# EAGLE design MiSTer Vector v1.0 (EAGLE 7.1.0)
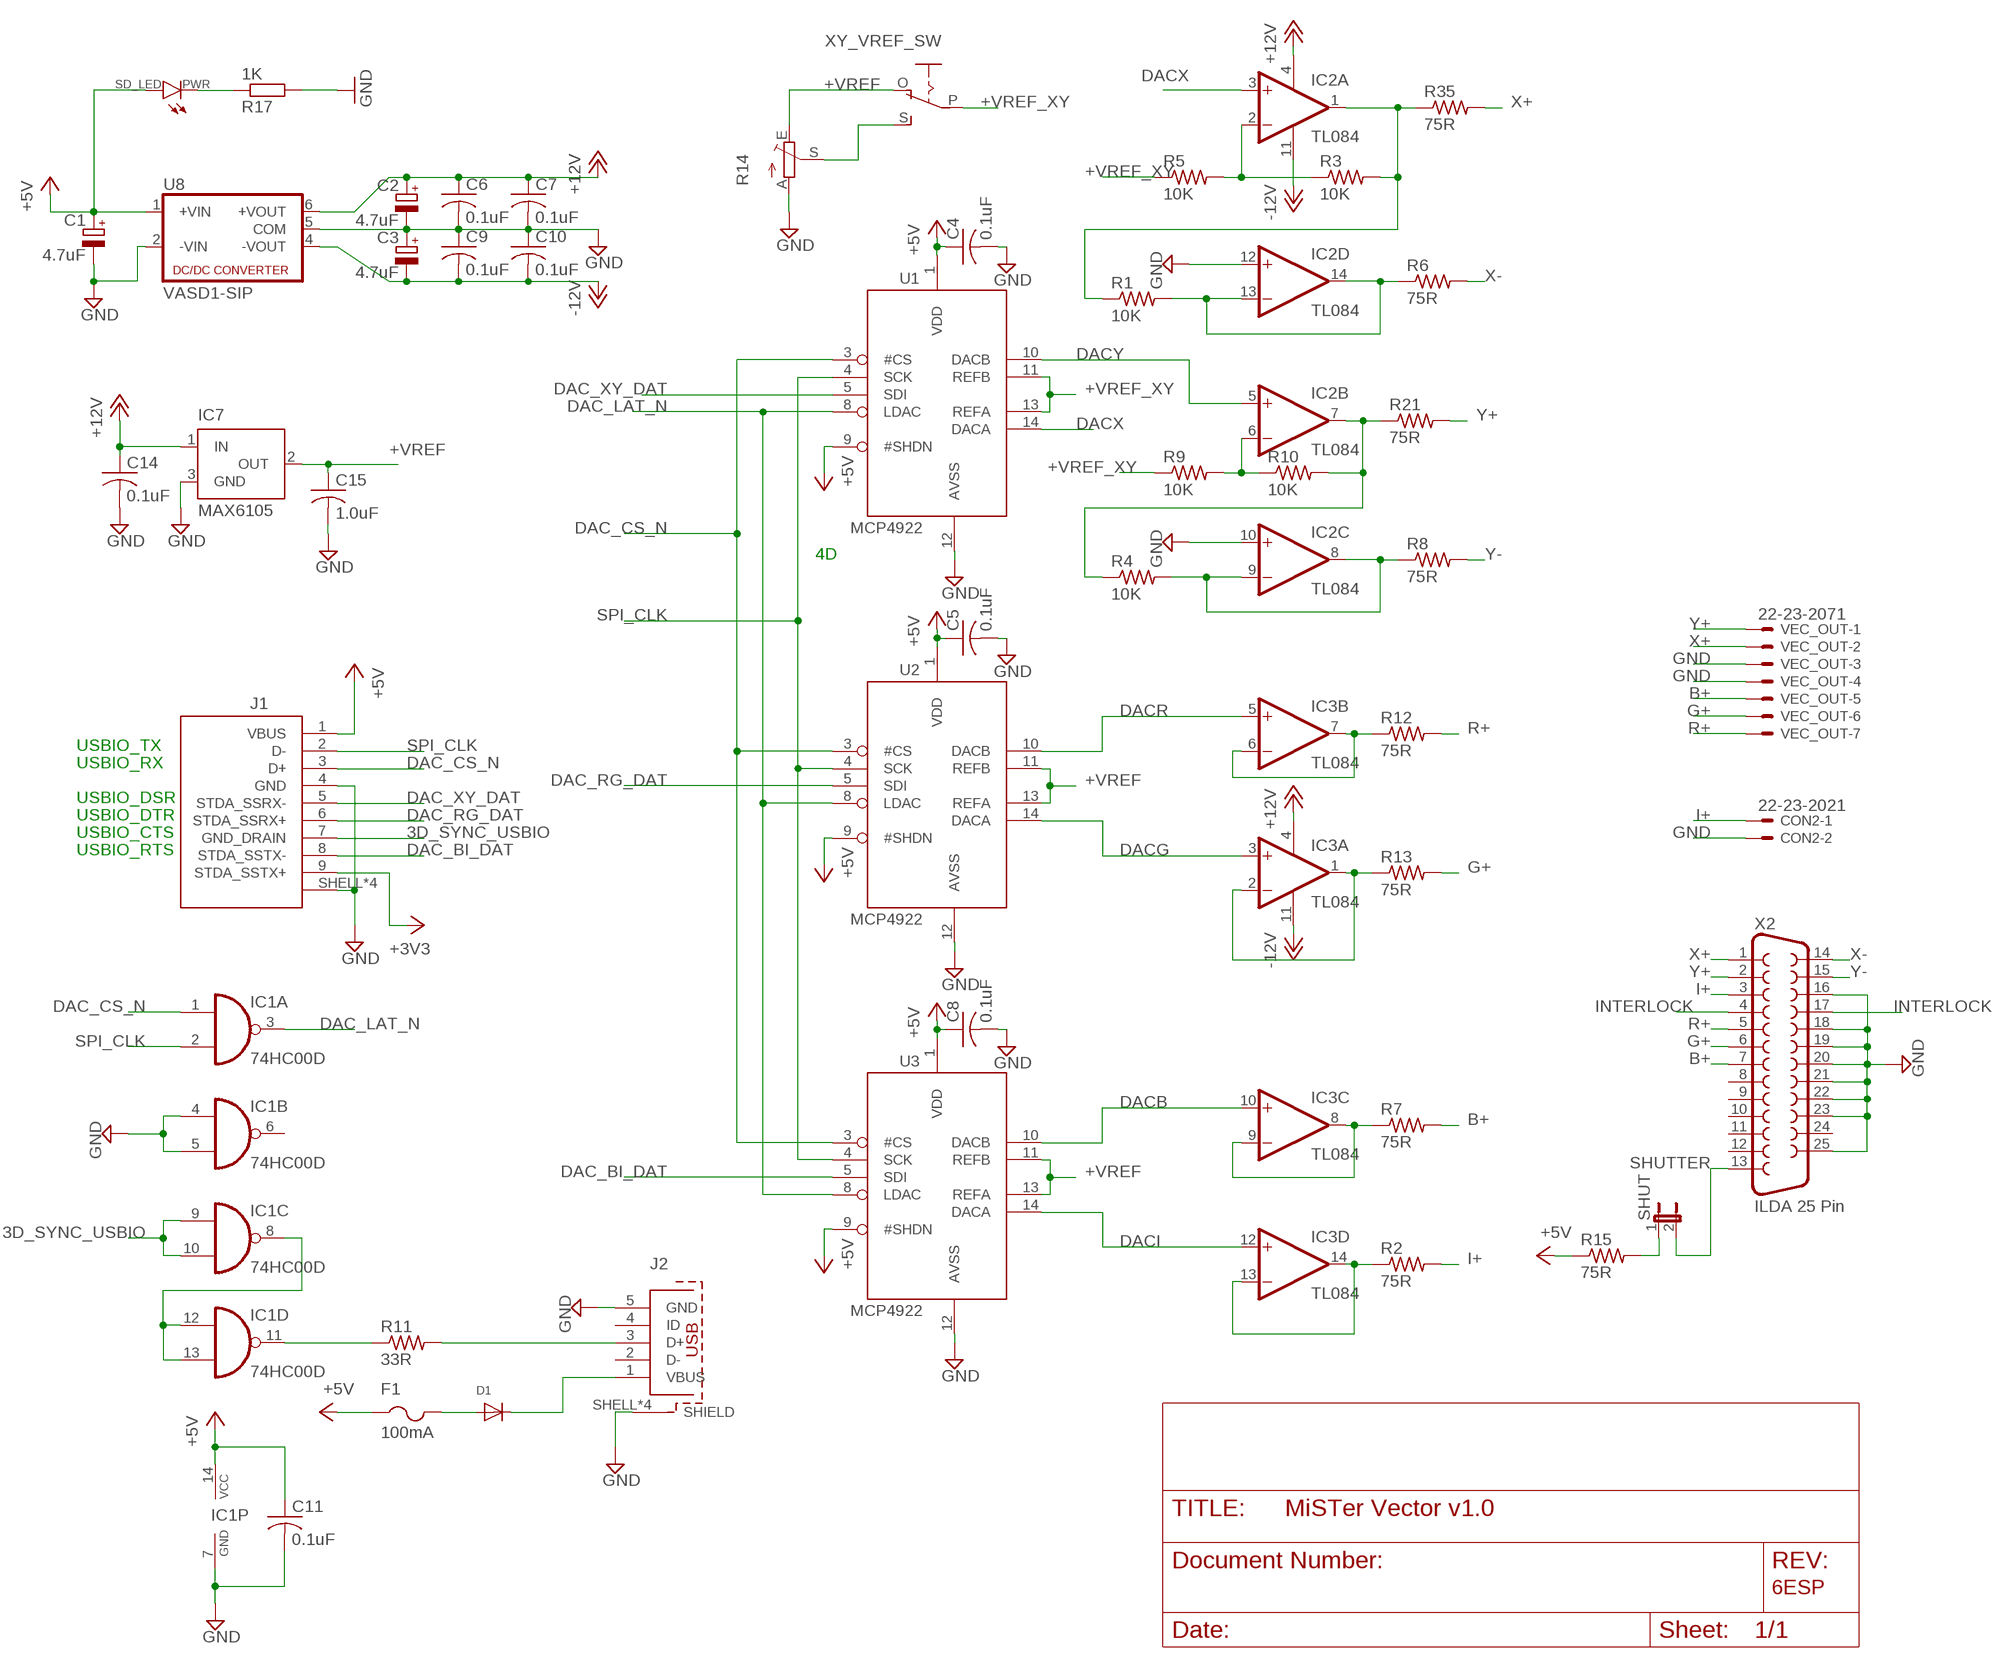
[diagram p0: schematic, sheet 1]

## Parts
C1  4.7uF  CPOL-EUCT6032  [CT6032]
C2  4.7uF  CPOL-EUCT6032  [CT6032]
C3  4.7uF  CPOL-EUCT6032  [CT6032]
C4  0.1uF  C-USC0603  [C0603]
C5  0.1uF  C-USC0603  [C0603]
C6  0.1uF  C-USC0603  [C0603]
C7  0.1uF  C-USC0603  [C0603]
C8  0.1uF  C-USC0603  [C0603]
C9  0.1uF  C-USC0603  [C0603]
C10  0.1uF  C-USC0603  [C0603]
C11  0.1uF  C-USC0603  [C0603]
C14  0.1uF  C-USC0603  [C0603]
C15  1.0uF  C-USC0603  [C0603]
CON2  22-23-2021  [22-23-2021]
D1  DIODESOD-323F  [SOD-323F]
F1  100mA  PTCFUSE-1206  [R1206]
IC1  74HC00D  [SO14]
IC2  TL084  [SOIC-14]
IC3  TL084  [SOIC-14]
IC7  MAX6105  MAX6520  [SOT23]
J1  692121230100  [692121230100]
J2  65100516121  [65100516121]
PWR  SD_LED  LED0805  [0805_POL]
R1  10K  R-US_R0603  [R0603]
R2  75R  R-US_R0603  [R0603]
R3  10K  R-US_R0603  [R0603]
R4  10K  R-US_R0603  [R0603]
R5  10K  R-US_R0603  [R0603]
R6  75R  R-US_R0603  [R0603]
R7  75R  R-US_R0603  [R0603]
R8  75R  R-US_R0603  [R0603]
R9  10K  R-US_R0603  [R0603]
R10  10K  R-US_R0603  [R0603]
R11  33R  R-US_R0603  [R0603]
R12  75R  R-US_R0603  [R0603]
R13  75R  R-US_R0603  [R0603]
R14  TRIM_EU-B25P  [B25P]
R15  75R  R-US_R0603  [R0603]
R17  1K  R-EU_R0603  [R0603]
R21  75R  R-US_R0603  [R0603]
R35  75R  R-US_R0603  [R0603]
SHUT  JP1E  [JP1]
U1  MCP4922  [SOIC-14]
U2  MCP4922  [SOIC-14]
U3  MCP4922  [SOIC-14]
U8  VASD1-SIP  NMA  [NMA]
VEC_OUT  22-23-2071  [22-23-2071]
X2  ILDA 25 Pin  F25D  [F25D]
XY_VREF_SW  EG1218S  [EG1218]

## Nets
3D_SYNC_USBIO: IC1.9(C:I0) IC1.10(C:I1) J1.7(GND_DRAIN)
+3V3: J1.9(STDA_SSTX+)
+5V: C1.+ C4.1 C5.1 C8.1 C11.1 F1.1 IC1.14(P:VCC) J1.1(VBUS) PWR.+(A) R15.1 U1.1(VDD) U1.9(#SHDN) U2.1(VDD) U2.9(#SHDN) U3.1(VDD) U3.9(#SHDN) U8.1(+VIN)
+12V: C2.+ C6.1 C7.1 C14.1 IC2.4(A:V+) IC3.4(A:V+) IC7.1(IN) U8.6(+VOUT)
+VREF: C15.1 IC7.2(OUT) R14.E U2.11(REFB) U2.13(REFA) U3.11(REFB) U3.13(REFA) XY_VREF_SW.O
+VREF_XY: R5.1 R9.1 U1.11(REFB) U1.13(REFA) XY_VREF_SW.P
-12V: C3.- C9.2 C10.2 IC2.11(A:V-) IC3.11(A:V-) U8.4(-VOUT)
B1+: IC3.8(C:OUT) IC3.9(C:-IN) R7.1
B+: R7.2 VEC_OUT.5 X2.7
DAC_BI_DAT: J1.8(STDA_SSTX-) U3.5(SDI)
DAC_CS_N: IC1.1(A:I0) J1.3(D+) U1.3(#CS) U2.3(#CS) U3.3(#CS)
DAC_LAT_N: IC1.3(A:O) U1.8(LDAC) U2.8(LDAC) U3.8(LDAC)
DAC_RG_DAT: J1.6(STDA_SSRX+) U2.5(SDI)
DAC_XY_DAT: J1.5(STDA_SSRX-) U1.5(SDI)
DACB: IC3.10(C:+IN) U3.10(DACB)
DACG: IC3.3(A:+IN) U2.14(DACA)
DACI: IC3.12(D:+IN) U3.14(DACA)
DACR: IC3.5(B:+IN) U2.10(DACB)
DACX: IC2.3(A:+IN) U1.14(DACA)
DACY: IC2.5(B:+IN) U1.10(DACB)
G1+: IC3.1(A:OUT) IC3.2(A:-IN) R13.1
G+: R13.2 VEC_OUT.6 X2.6
GND: C1.- C2.- C3.+ C4.2 C5.2 C6.2 C7.2 C8.2 C9.1 C10.1 C11.2 C14.2 C15.2 CON2.2 IC1.4(B:I0) IC1.5(B:I1) IC1.7(P:GND) IC2.10(C:+IN) IC2.12(D:+IN) IC7.3(GND) J1.4(GND) J1.SHELL1(SHIELD) J1.SHELL2(SHIELD) J1.SHELL3(SHIELD) J1.SHELL(SHIELD) J2.5(GND) J2.SHELL1(SHIELD) J2.SHELL2(SHIELD) J2.SHELL3(SHIELD) J2.SHELL(SHIELD) R14.A R17.2 U1.12(AVSS) U2.12(AVSS) U3.12(AVSS) U8.2(-VIN) U8.5(COM) VEC_OUT.3 VEC_OUT.4 X2.16 X2.18 X2.19 X2.20 X2.21 X2.22 X2.23 X2.25
I1+: IC3.13(D:-IN) IC3.14(D:OUT) R2.1
I+: CON2.1 R2.2 X2.3
INTERLOCK: X2.4 X2.17
N$1: IC2.1(A:OUT) R1.1 R3.2 R35.1
N$2: IC2.7(B:OUT) R4.1 R10.2 R21.1
N$3: IC2.6(B:-IN) R9.2 R10.1
N$4: IC2.8(C:OUT) IC2.9(C:-IN) R4.2 R8.1
N$5: IC2.13(D:-IN) IC2.14(D:OUT) R1.2 R6.1
N$6: D1.C J2.1(VBUS)
N$7: IC1.11(D:O) R11.1
N$8: IC1.8(C:O) IC1.12(D:I0) IC1.13(D:I1)
N$9: J2.3(D+) R11.2
N$10: PWR.-(C) R17.1
N$11: D1.A F1.2
N$12: R15.2 SHUT.1
N$13: R14.S XY_VREF_SW.S
N$30: IC2.2(A:-IN) R3.1 R5.2
R1+: IC3.6(B:-IN) IC3.7(B:OUT) R12.1
R+: R12.2 VEC_OUT.7 X2.5
SHUTTER: SHUT.2 X2.13
SPI_CLK: IC1.2(A:I1) J1.2(D-) U1.4(SCK) U2.4(SCK) U3.4(SCK)
X+: R35.2 VEC_OUT.2 X2.1
X-: R6.2 X2.14
Y+: R21.2 VEC_OUT.1 X2.2
Y-: R8.2 X2.15
Unconnected: IC1.6(B:O) J2.2(D-) J2.4(ID) X2.8 X2.9 X2.10 X2.11 X2.12 X2.24

## Notes on the sheet
- 4D
- USBIO_TX
- USBIO_RX
- USBIO_DSR
- USBIO_DTR
- USBIO_CTS
- USBIO_RTS
- 6ESP

## Library data of the parts
C1-C3 = rcl:CPOL-EU: POLARIZED CAPACITOR, European symbol
C4-C11 C14 C15 = adafruit:C-US: CAPACITOR, American symbol
CON2 = con-molex:22-23-2021: .100" (2.54mm) Center Header - 2 Pin; MF: MOLEX; MPN: 22-23-2021; OC_FARNELL: 1462926; OC_NEWARK: 25C3832
D1 = adafruit:DIODE: Diode SMADIODE - SMA Surface Mount Package 20V 1A Schottky Diode Digikey: 641-1014-6-ND DO-1N4148 - Through Hole Small Current Diode SOD-123 20V 1 A (.5mV Vf) Schottky Diode - Digikey: MBRX120TPMSCT-ND SOD-323 10V 570mA (.38mV Vf, 3ns) Schottky Diode - Digikey: ZLLS410CT-ND SOD-523 30V 30mA Schottky Diode (RB751S-40TE61) - Digikey: RB751S-40TE61CT-ND SOT23-R/W - SOT23 Package (R = Solder Paste/Reflow Ovens, W = Hand-Soldering) BAT54Film 40V 300mA - Digikey: 497-7162-1-ND
F1 = adafruit:PTCFUSE: PTC fuses, resettable thermistors
IC1 = 74xx-eu:74*00: Quad 2-input NAND gate
IC2 IC3 = favreau:TL084: Texas Instruments TL084 JFET General Purpose Op-Amp
IC7 = maxim:MAX6520: 1.2V Voltage Reference 50ppm/°C, SOT23, 3-Terminal Source: Data sheet <http://datasheets.maxim-ic.com/en/ds/MAX6520.pdf>; MF: MAXIM; MPN: MAX6520EUR-T; OC_FARNELL: unknown; OC_NEWARK: 02J4586
J1 = 632723100011_Eagle_WR-USB_rev19b:692121230100: WR-COM - USB 3.0 HORIZONTAL TYPE A WITH OFFSET 1.04 MM Characteristics MATERIAL PROPERTIES INSULATOR: Color Blue Insulator Material LCP Contact Material Phosphor Bronze Contact Plating Mat Tin over Nickel Contact Type Stamped Cover Material Brass Cover PlatingMat Tin KIND PROPERTIES Quality Class50 000 Mating cycles GENERAL INFORMATION Operating Temperature -20 °C up to +60 °C Insulator Flammability Rating UL94-V0 ELECTRICAL PROPERTIES Rated Current 0.25 A Working Voltage 30 V (AC) Withstanding Voltage 100 V (AC) Contact Resistance 50 mΩ Insulation Resistance 100 MΩ PACKAGING PROPERTIES Packaging Tape and Reel <http://katalog.we-online.de/media/images/v2/Family_WR-COM_692121230100.jpg> Details see: http://katalog.we-online.de/en/em/COM_3_0_TYPE_A_HORIZONTAL_W_OFFSET_1_04MM 2016 (C) Wurth Elektronik
J2 = 632723100011_Eagle_WR-USB_rev19b:65100516121: WR-COM SMT Horizontal 5 Contacts Mini USB Typ B=>Code : Con_I-O_COM_MiniUSB_65100516121 <http://katalog.we-online.de/media/images/eican/Con_I-O_COM_MiniUSB_65100516121_pf2.jpg> Details see: http://katalog.we-online.de/en/em/COM_SMT_MINI_TYPE_B_HORIZONTAL/65100516121 Created 2014-07-09, Karrer Zheng 2014 (C) Würth Elektronik
PWR = dan-led:LED: LED
R1-R13 R15 R21 R35 = resistor:R-US_: RESISTOR, American symbol
R14 = pot:TRIM_EU-: POTENTIOMETER
R17 = rcl:R-EU_: RESISTOR, European symbol
SHUT = jumper:JP1E: JUMPER
U1-U3 = favreau:MCP4922
U8 = dc-dc-converter:NMA: DC-DC CONVERTER; MF: C & D TECHNOLOGIES, INC; MPN: NMA0515SC; OC_FARNELL: 1021434; OC_NEWARK: 61K3064
VEC_OUT = con-molex:22-23-2071: .100" (2.54mm) Center Header - 7 Pin; MF: MOLEX; MPN: 22-23-2071; OC_FARNELL: 1654534; OC_NEWARK: 56H0445
X2 = SparkFun:F25: D-SUB 25 25 Pin male connector. PCB edge mount for regular PCB thicknesses. This connector will connect directly to the back of a PC parallel port or through a normal DB25 extension cable (M/F). SKU: PRT-08287
XY_VREF_SW = adafruit:EG1218: SLIDING SWITCH 0.1" spacing through hole, vertical SPDT slide switch http://www.ladyada.net/library/pcb/eaglelibrary.html

## Board
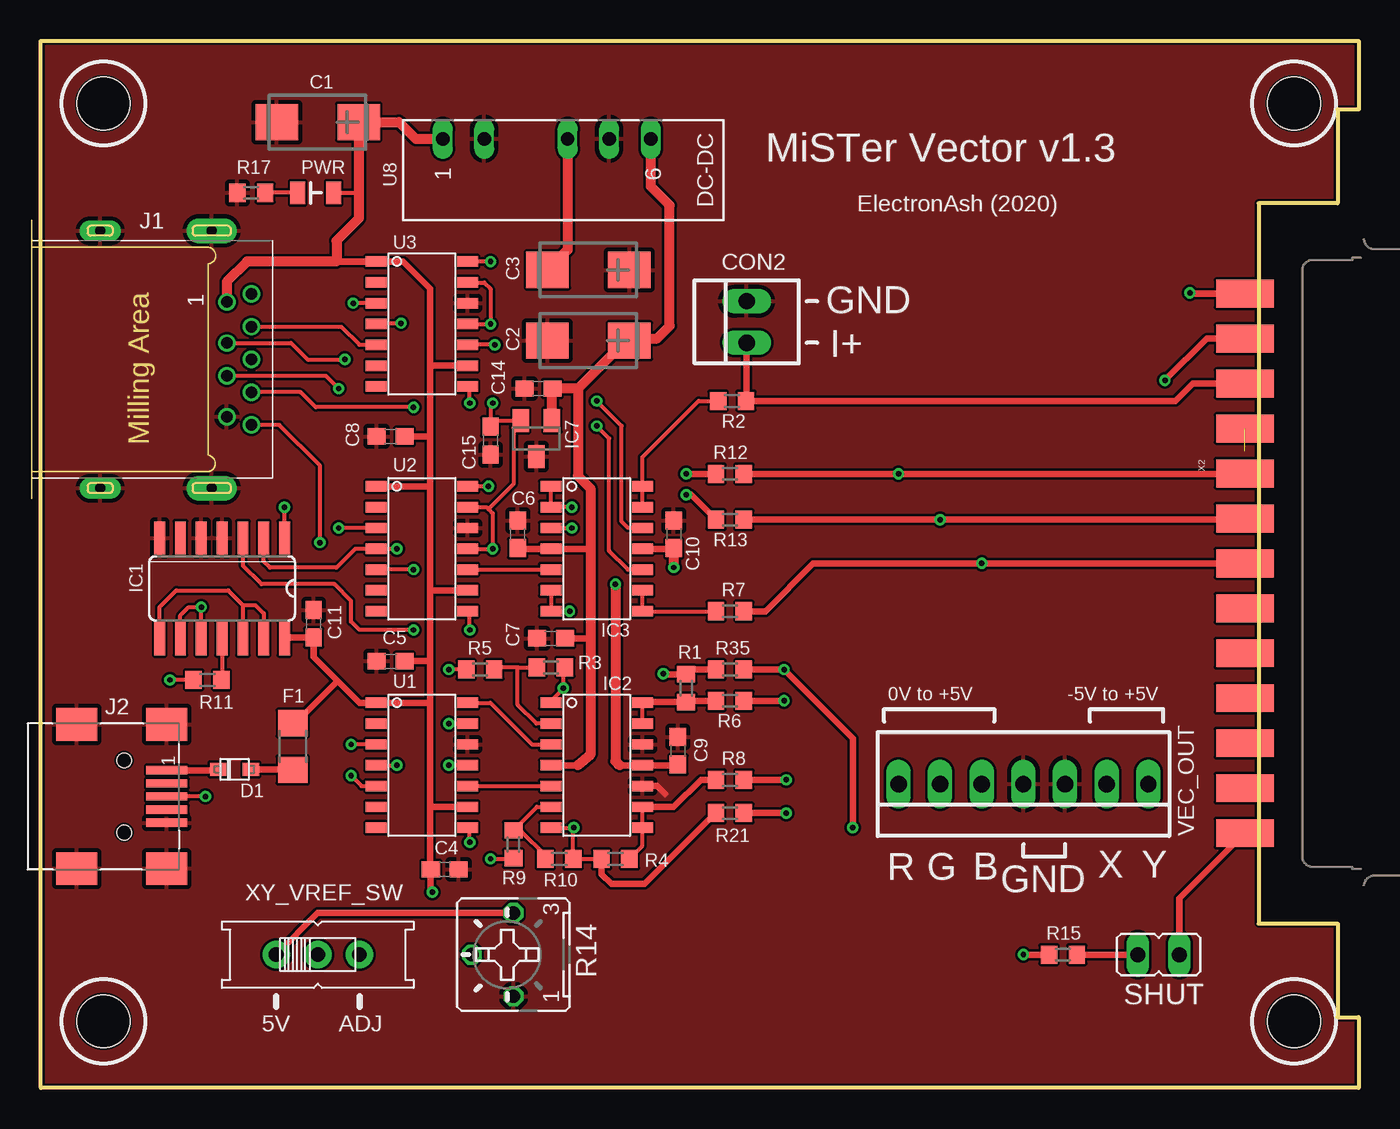
[diagram p1: board, top side]
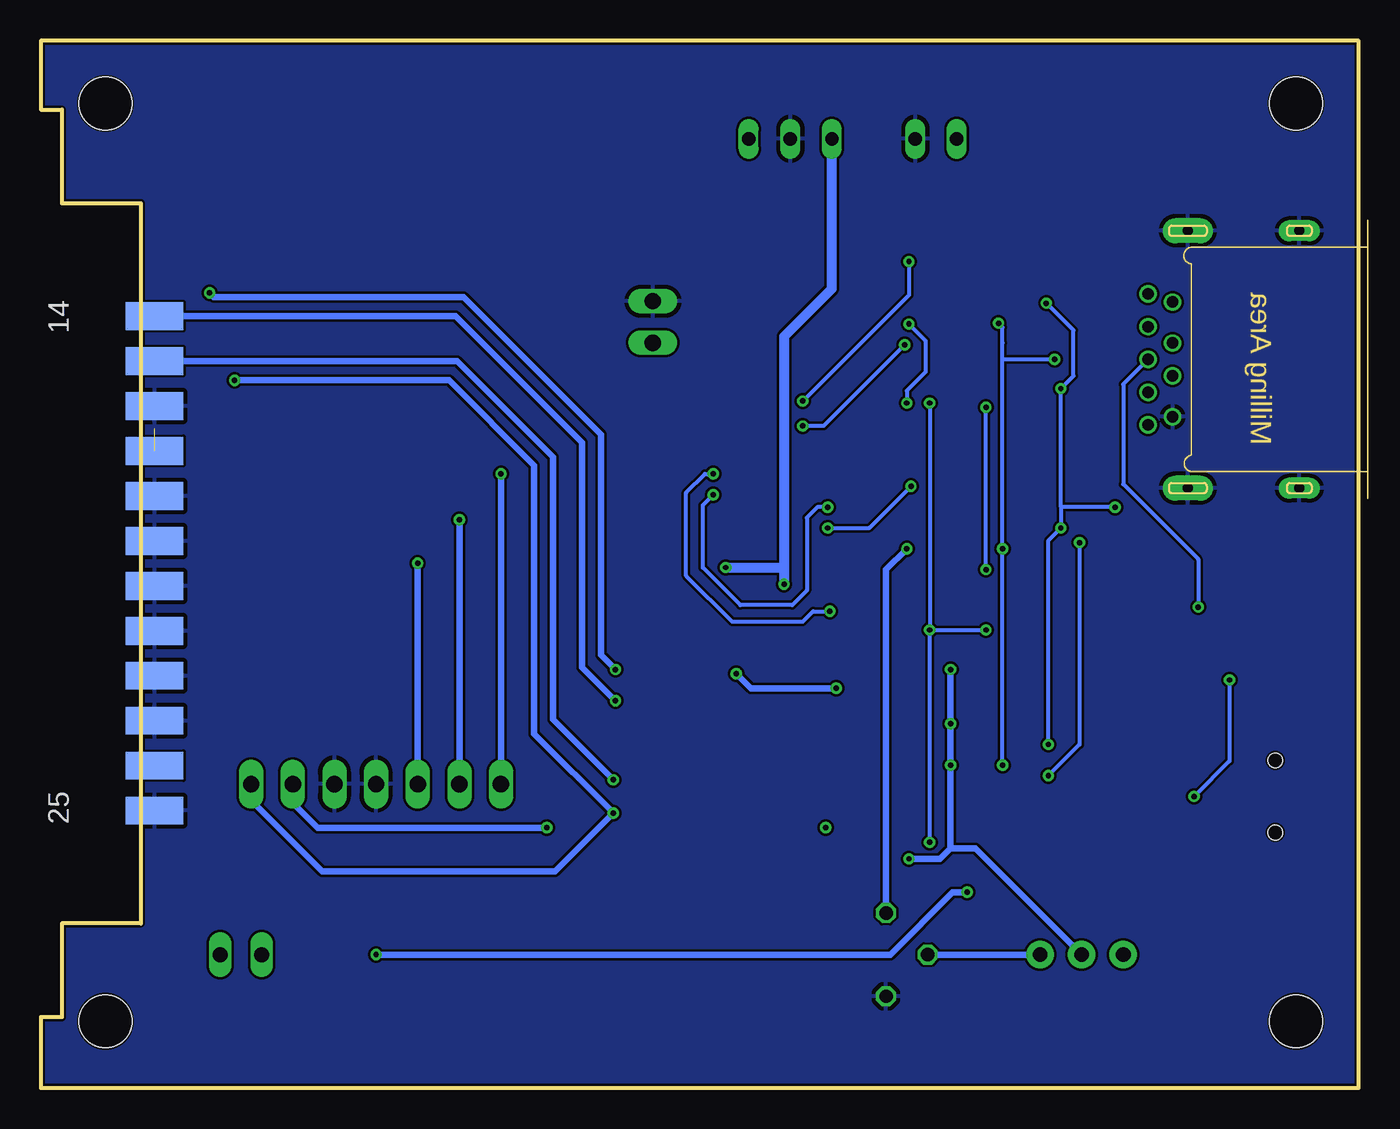
[diagram p2: board, bottom side, seen from below]

Size 80.39 x 63.88 mm. Coordinates in mm from the lower left corner, seen from the top.
Outline: 0,63.88 80.39,63.88 80.39,59.69 79.12,59.69 79.12,53.98 74.3,53.98 74.3,10.03 79.12,10.03 79.12,4.32 80.39,4.32 80.39,0 0,0 0,63.88
Copper layers (1*16): Top 0.0356mm / dielectric 1.5011mm / Bottom 0.0356mm
Design rules "LaenPCBOrder *": minimum track width 6mil, minimum drill 13mil, track to track 6mil, track to pad 6mil, pad to pad 6mil, via to via 6mil, smd to smd 6mil, copper to edge 5mil, drill to drill 6mil, minimum pad ring 7mil, minimum via ring 7mil, stop-mask expansion 4mil, vias tented up to drill 0mil, thermal gap 10mil
Holes 3.2 mm at 3.81,4.06 3.81,60.07 76.45,4.06 76.45,60.07

### Footprints (pad centres in the part's own frame; a part is rotated, then mirrored left to right if it is on the bottom)
CT6032 = smd 2.6 x 2.2: + -2.5,0; - 2.5,0
C0603 = smd 1.1 x 1: 1 -0.85,0; 2 0.85,0
22-23-2021 = drill 1 long: 1 -1.27,0; 2 1.27,0
SOD-323F = smd 1 x 0.8: A -1,0; C 1,0
R1206 = smd 1.6 x 1.803: 1 -1.422,0; 2 1.422,0
SO14 = smd 0.66 x 2.032: 1 -3.81,-3.073; 2 -2.54,-3.073; 3 -1.27,-3.073; 4 0,-3.073; 5 1.27,-3.073; 6 2.54,-3.073; 7 3.81,-3.073; 8 3.81,3.073; 9 2.54,3.073; 10 1.27,3.073; 11 0,3.073; 12 -1.27,3.073; 13 -2.54,3.073; 14 -3.81,3.073
SOIC-14 = smd 1.27 x 0.635: 1 -0.762,-0.508; 2 -0.762,-1.778; 3 -0.762,-3.048; 4 -0.762,-4.318; 5 -0.762,-5.588; 6 -0.762,-6.858; 7 -0.762,-8.128; 8 4.826,-8.128; 9 4.826,-6.858; 10 4.826,-5.588; 11 4.826,-4.318; 12 4.826,-3.048; 13 4.826,-1.778; 14 4.826,-0.508
SOT23 = smd 1 x 1.4: 1 -0.95,-1.1; 2 0.95,-1.1; 3 0,1.1
692121230100 = drill 0.7: 1 -3.5,0.93; 2 -1,0.93; 3 1,0.93; 4 3.5,0.93; 5 4,2.43; 6 2,2.43; 7 0,2.43; 8 -2,2.43; 9 -4,2.43 | drill 0.6 pad 1.54 long: SHELL -7.85,0; SHELL1 7.85,0 | drill 0.6 pad 1.27 long: SHELL2 -7.85,-6.8; SHELL3 7.85,-6.8
65100516121 = smd 0.5 x 2.5: 1 -1.6,2.6; 2 -0.8,2.6; 3 0,2.6; 4 0.8,2.6; 5 1.6,2.6 | smd 2 x 2.5: SHELL -4.4,2.6; SHELL1 4.4,2.6; SHELL2 -4.4,-2.9; SHELL3 4.4,-2.9 | hole 0.9: -2.2,0; 2.2,0
0805_POL = smd 0.9 x 1.4: + 1.1,0; - -1.1,0
R0603 = smd 1 x 1.1: 1 -0.85,0; 2 0.85,0
B25P = drill 0.813 octagon: A -2.54,0; E 2.54,0; S 0,2.54
JP1 = drill 0.914 long: 1 0,-1.27; 2 0,1.27
NMA = drill 0.813 long: 1 0,6.35; 2 0,3.81; 4 0,-1.27; 5 0,-3.81; 6 0,-6.35
22-23-2071 = drill 1 long: 1 -7.62,0; 2 -5.08,0; 3 -2.54,0; 4 0,0; 5 2.54,0; 6 5.08,0; 7 7.62,0
F25D = smd 1.7 x 3.5: 1 -16.459,-6.045; 2 -13.716,-6.045; 3 -10.973,-6.045; 4 -8.23,-6.045; 5 -5.486,-6.045; 6 -2.743,-6.045; 7 0,-6.045; 8 2.743,-6.045; 9 5.486,-6.045; 10 8.23,-6.045; 11 10.973,-6.045; 12 13.716,-6.045; 13 16.459,-6.045 | smd 1.7 x 3.5 bottom: 14 -15.088,-6.045; 15 -12.344,-6.045; 16 -9.601,-6.045; 17 -6.858,-6.045; 18 -4.115,-6.045; 19 -1.372,-6.045; 20 1.372,-6.045; 21 4.115,-6.045; 22 6.858,-6.045; 23 9.601,-6.045; 24 12.344,-6.045; 25 15.088,-6.045
EG1218 = drill 0.9 pad 1.676: O -2.54,0; P 0,0; S 2.54,0

### Placement (x,y rotation side)
C1  16.89,58.93 180 top
C2  33.4,45.59 180 top
C3  33.4,49.91 180 top
C4  24.64,13.34 0 top
C5  21.34,26.04 180 top
C6  29.08,33.78 90 top
C7  31.12,27.43 180 top
C8  21.34,39.75 180 top
C9  38.86,20.57 270 top
C10  38.61,33.78 270 top
C11  16.64,28.32 90 top
C14  30.35,42.67 180 top
C15  27.43,39.5 270 top
CON2  43.05,46.74 90 top
D1  11.81,19.43 180 top
F1  15.37,20.83 270 top
IC1  11.05,30.48 180 top
IC2  31.88,24 0 top
IC3  31.88,37.21 0 top
IC7  30.23,39.62 180 top
J1  10.41,44.45 270 top
J2  5.08,17.78 270 top
PWR  16.76,54.61 0 top
R1  39.37,24.38 270 top
R2  42.16,41.91 0 top
R3  31.12,25.65 0 top
R4  35.05,13.97 0 top
R5  26.8,25.53 0 top
R6  42.04,23.62 0 top
R7  42.04,29.08 0 top
R8  42.04,18.8 0 top
R9  28.83,14.86 90 top
R10  31.62,13.97 0 top
R11  10.16,24.89 180 top
R12  42.04,37.47 0 top
R13  42.04,34.67 0 top
R14  28.83,8.13 90 top
R15  62.36,8.13 0 top
R17  12.83,54.61 180 top
R21  42.04,16.76 0 top
R35  42.04,25.53 0 top
SHUT  68.2,8.13 270 top
U1  21.21,24 0 top
U2  21.21,37.21 0 top
U3  21.21,50.93 0 top
U8  30.86,57.91 90 top
VEC_OUT  59.94,18.54 180 top
X2  79.5,32 270 top
XY_VREF_SW  16.89,8.13 0 top

### Tracks (layer width: path | path; a pad name or v marks a point on that pad's centre or on a via)
3D_SYNC_USBIO  (via drill 0.33)
  Top 0.254: IC1.10 v9.78,29.34 9.02,29.34 8.51,28.83 IC1.9
  Bottom 0.254: J1.7 14.35,42.94 14.35,36.83 9.78,32.26 v9.78,29.34
+5V  (via drill 0.33)
  Top 0.254: PWR.+ 19.39,54.61 | IC1.14 14.99,27.47
  Top 0.406: 23.75,17.14 23.75,23.5 | U1.9 23.75,17.14 | 23.75,23.5 U1.1 19.43,23.5 18.1,24.83 | 23.75,23.5 23.75,26.04 | 23.75,26.04 23.75,30.35 | 23.75,30.35 23.75,36.7 | 23.75,36.7 23.75,39.75 | 23.75,39.75 23.75,44.07 | C8.1 23.75,39.75 | U3.9 23.75,44.07 | U2.9 23.75,30.35 | C5.1 23.75,26.04 | U2.1 23.75,36.7 | 18.1,24.83 16.64,26.29 C11.1 14.99,27.47 | 23.75,17.14 23.75,13.37 C4.1 23.79,12.03 v23.88,11.94 | F1.1 15.52,22.25 18.1,24.83 | 23.75,44.07 23.75,48.77 22.1,50.42 U3.1 18.03,50.42 | R15.1 v59.94,8.13
  Top 0.61: U8.1 22.86,57.91 21.84,58.93 C1.+ 19.39,54.61 19.39,53.05 18.03,51.69 18.03,50.42 12.57,50.42 11.34,49.19 J1.1
  Bottom 0.406: v59.94,8.13 28.58,8.13 24.77,11.94 v23.88,11.94
+12V
  Top 0.406: C6.1 29.17,32.89 IC3.4 33.53,32.89 | 32.77,19.68 IC2.4 | C7.1 33.53,27.43
  Top 0.61: 35.18,45.72 35.77,45.72 | 35.77,45.72 C2.+ 35.69,45.59 32.77,42.67 | 32.77,19.68 33.53,20.32 33.53,27.43 33.53,32.89 33.53,36.58 32.77,37.34 32.77,42.67 | 35.77,45.72 37.59,45.72 38.35,46.48 38.35,53.85 37.21,54.99 U8.6 | 32.77,42.67 C14.1 31.18,42.65 IC7.1
+VREF  (via drill 0.33)
  Top 0.254: 27.34,40.26 C15.1 | U3.11 v27.43,46.61 27.43,48.77 27.05,49.15 U3.13 | v27.56,41.78 27.43,41.66 C15.1 | U2.13 27.18,35.43 27.3,35.31 | 27.3,35.31 27.56,35.05 v27.56,32.89 U2.11 | 27.3,35.31 28.83,36.83 28.83,40.28 IC7.2 27.81,40.72 C15.1
  Top 0.406: XY_VREF_SW.O 16.89,10.67 R14.E
  Bottom 0.254: v27.43,46.61 26.42,45.59 26.42,43.69 27.56,42.55 v27.56,41.78
  Bottom 0.406: v27.56,32.89 28.83,31.62 R14.E
+VREF_XY  (via drill 0.33)
  Top 0.254: R5.1 v24.89,25.53 | v24.89,22.23 U1.13 | v27.43,13.97 28.79,13.97 R9.1 | U1.11 v24.89,19.68
  Bottom 0.406: v24.89,25.53 v24.89,22.23 v24.89,19.68 24.89,14.61 | 24.89,14.61 25.53,13.97 v27.43,13.97 | XY_VREF_SW.P 23.37,14.61 24.89,14.61
-12V  (via drill 0.33)
  Top 0.406: IC3.11 38.31,32.89 C10.2 | 35.31,19.68 IC2.11 38.82,19.68 C9.2
  Top 0.61: C10.2 v38.61,31.75 | v35.05,30.73 35.05,19.94 35.31,19.68 | U8.4 32.13,51.14 C3.-
  Bottom 0.61: U8.4 32.13,48.77 35.05,45.85 35.05,31.75 | 35.05,31.75 v35.05,30.73 | v38.61,31.75 35.05,31.75
B1+
  Top 0.254: IC3.9 IC3.8 R7.1
B+  (via drill 0.33)
  Top 0.406: R7.2 44.2,29.08 47.12,32 v57.4,32 X2.7
  Bottom 0.406: VEC_OUT.5 v57.4,32
DAC_BI_DAT
  Top 0.254: J1.8 18.32,46.45 19.43,45.34 U3.5
DAC_CS_N  (via drill 0.33)
  Top 0.254: U1.3 v18.92,20.95 | U2.3 v18.16,34.16 | IC1.1 v14.86,35.43 | J1.3 17.38,43.45 v18.16,42.67 | U3.3 v19.05,47.88
  Bottom 0.254: v18.92,20.95 18.92,33.4 v18.16,34.16 18.16,35.43 | v14.86,35.43 18.16,35.43 | 18.16,35.43 v18.16,42.67 17.4,43.43 17.4,46.23 v19.05,47.88
DAC_LAT_N  (via drill 0.33)
  Top 0.254: v26.16,14.99 26.16,15.88 U1.8 | v26.16,41.78 26.16,42.8 U3.8 | v26.16,27.94 26.16,29.08 U2.8 | IC1.3 12.32,31.88 13.46,30.73 17.91,30.73 18.92,29.72 18.92,28.45 19.43,27.94 v22.73,27.94
  Bottom 0.254: v26.16,41.78 v26.16,27.94 | v26.16,27.94 v22.73,27.94 | v26.16,14.99 v26.16,27.94
DAC_RG_DAT  (via drill 0.33)
  Top 0.254: v22.73,31.62 U2.5 | v22.73,41.53 16.76,41.53 15.84,42.45 J1.6
  Bottom 0.254: v22.73,31.62 v22.73,41.53
DAC_XY_DAT  (via drill 0.33)
  Top 0.254: v18.92,19.05 19.56,18.41 U1.5 | v17.02,33.27 17.02,37.97 14.54,40.45 J1.5
  Bottom 0.254: v17.02,33.27 17.02,20.95 v18.92,19.05
DACB  (via drill 0.33)
  Top 0.254: IC3.10 35.81,31.62 34.67,32.77 34.67,39.62 v33.91,40.39 | v27.69,45.34 U3.10
  Bottom 0.254: v27.69,45.34 32.64,40.39 v33.91,40.39
DACG  (via drill 0.33)
  Top 0.254: IC3.3 v32.39,34.16 | v27.3,36.7 U2.14
  Bottom 0.254: v32.39,34.16 29.84,34.16 v27.3,36.7
DACI  (via drill 0.33)
  Top 0.254: IC3.12 35.81,34.16 35.43,34.54 35.43,40.39 v33.91,41.91 | v27.43,50.42 U3.14
  Bottom 0.254: v27.43,50.42 27.43,48.39 v33.91,41.91
DACR
  Top 0.254: U2.10 IC3.5
DACX
  Top 0.254: U1.14 27.43,23.5 29.97,20.95 IC2.3
DACY
  Top 0.254: U1.10 IC2.5
G1+  (via drill 0.33)
  Top 0.254: IC3.1 IC3.2 v32.39,35.43
  Top 0.406: R13.1 39.66,36.2 v39.37,36.2
  Bottom 0.254: v32.39,35.43 33.02,35.43 33.66,34.8 33.66,30.35 34.54,29.46 37.72,29.46 40.01,31.75 40.01,35.56 v39.37,36.2
G+  (via drill 0.33)
  Top 0.406: R13.2 v54.86,34.67 73.38,34.67 X2.6
  Bottom 0.406: VEC_OUT.6 v54.86,34.67
GND
  Top 0.406: IC2.10 37.59,18.41 38.06,17.95
  pour Bottom (isolate 0.127): 0,63.88 0,0 80.39,0 80.39,4.32 79.12,4.32 79.12,10.03 74.3,10.03 74.3,53.98 79.12,53.98 79.12,59.69 80.39,59.69 80.39,63.88
  pour Top (isolate 0.127): 0,63.88 0,0 80.39,0 80.39,4.32 79.12,4.32 79.12,10.03 74.3,10.03 74.3,53.98 79.12,53.98 79.12,59.69 80.39,59.69 80.39,63.88
I1+
  Top 0.254: IC3.13 IC3.14 36.7,38.48 40.13,41.91 R2.1
I+
  Top 0.406: X2.3 70.28,42.98 69.22,41.91 R2.2 43.05,41.95 CON2.1
INTERLOCK  (1 unrouted)
N$1  (via drill 0.33)
  Top 0.254: IC2.1 31.12,23.62 v31.88,24.38 31.88,25.57 R3.2
  Top 0.406: R35.1 39.66,25.53 R1.1 38.01,25.23 v37.97,25.27
  Bottom 0.406: v31.88,24.38 37.08,24.38 v37.97,25.27
N$2  (via drill 0.33)
  Top 0.254: IC2.7 v32.51,15.88 32.47,15.84 R10.2 R4.1
  Top 0.406: R4.1 34.2,13.04 34.8,12.45 36.83,12.45 41.15,16.76 R21.1
N$3
  Top 0.254: R10.1 30.77,14.19 29.34,15.62 28.92,15.62 R9.2 30.27,17.14 IC2.6
N$4
  Top 0.254: IC2.9 IC2.8 36.7,14.77 R4.2
  Top 0.406: R8.1 40.26,18.8 38.61,17.14 IC2.9
N$5
  Top 0.254: IC2.13 IC2.14
  Top 0.406: IC2.14 36.74,23.53 R1.2 39.46,23.62 R6.1
N$6
  Top 0.406: J2.1 10.63,19.38 D1.C
N$7
  Top 0.254: IC1.11 11.05,24.93 R11.1
N$8
  Top 0.254: 12.32,29.46 13.08,29.46 13.59,28.96 IC1.13 | 12.32,29.46 IC1.12 | IC1.8 7.24,29.34 8.26,30.35 11.43,30.35 12.32,29.46
N$9  (via drill 0.33)
  Top 0.254: R11.2 v7.87,24.89 | v10.03,17.78 J2.3
  Bottom 0.254: v7.87,24.89 7.87,19.94 v10.03,17.78
N$10
  Top 0.254: PWR.- R17.1
N$11
  Top 0.406: D1.A 15.34,19.43 F1.2
N$12
  Top 0.406: R15.2 SHUT.1
N$13
  Bottom 0.406: XY_VREF_SW.S R14.S
N$30
  Top 0.254: 29.08,25.65 R3.1 | IC2.2 30.23,22.23 29.08,23.37 29.08,25.65 | 27.56,25.49 R5.2 27.77,25.65 29.08,25.65
R1+  (via drill 0.33)
  Top 0.254: IC3.6 IC3.7 v32.26,29.08
  Top 0.406: v39.37,37.47 R12.1
  Bottom 0.254: v32.26,29.08 33.27,29.08 33.91,28.45 38.23,28.45 41.02,31.24 41.02,36.32 39.88,37.47 v39.37,37.47
R+  (via drill 0.33)
  Top 0.406: R12.2 v52.32,37.47 73.43,37.47 X2.5
  Bottom 0.406: VEC_OUT.7 v52.32,37.47
SHUTTER
  Top 0.406: SHUT.2 69.47,11.56 X2.13
SPI_CLK  (via drill 0.33)
  Top 0.254: v21.72,32.89 U2.4 19.18,32.89 18.03,31.75 13.97,31.75 13.59,32.13 IC1.2 | U1.4 v21.72,19.68 | U3.4 20.5,46.66 v21.97,46.66 | J1.2 15.26,45.45 16.26,44.45 v18.54,44.45
  Bottom 0.254: v21.72,19.68 v21.72,32.89 21.72,44.45 | 21.72,44.45 21.72,45.47 | 21.72,45.47 21.72,46.4 v21.97,46.66 | 21.7,45.45 21.72,45.47 | v18.54,44.45 21.72,44.45
X+  (via drill 0.33)
  Top 0.406: R35.2 v45.34,25.53 49.53,21.34 v49.53,15.88 | v70.1,48.51 70.16,48.46 X2.1
  Bottom 0.406: v45.34,25.53 46.23,26.42 46.23,39.88 54.61,48.26 69.85,48.26 v70.1,48.51 | VEC_OUT.2 65.02,17.4 63.5,15.88 v49.53,15.88
X-  (via drill 0.33)
  Top 0.406: R6.2 v45.34,23.62
  Bottom 0.406: 73.43,47.12 X2.14 55.09,47.09 47.37,39.37 47.37,25.65 v45.34,23.62
Y+  (via drill 0.33)
  Top 0.406: v68.58,43.18 71.12,45.72 X2.2 | R21.2 v45.47,16.76
  Bottom 0.406: VEC_OUT.1 67.56,17.53 63.25,13.21 49.02,13.21 v45.47,16.76 50.29,21.59 50.29,37.97 55.5,43.18 v68.58,43.18
Y-  (via drill 0.33)
  Top 0.406: R8.2 v45.47,18.8
  Bottom 0.406: X2.15 55.02,44.35 49.15,38.48 49.15,22.48 v45.47,18.8

### Text on the board
tPlace: MiSTer Vector v1.3 | ElectronAsh (2020) | GND | I+ | 0V to +5V | -5V to +5V | R | G | B | GND | X | Y | 5V | ADJ
bNames: SDA | SCL | G | 5V
TallParts: USB | ISP | PWR
ArduinoHoles: 3.2mm | 2.2mm | 3.2mm